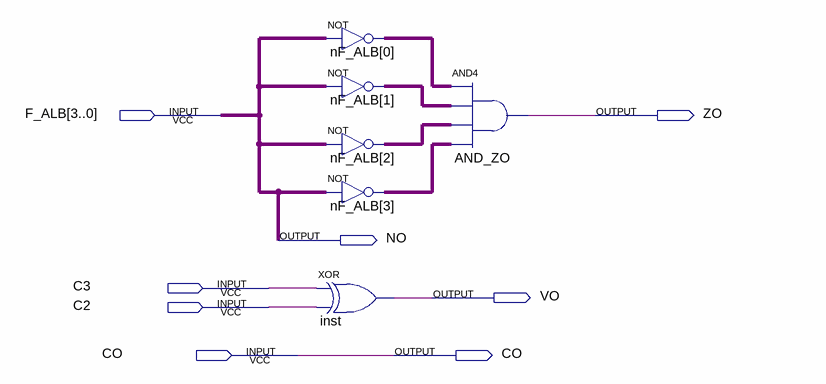
[diagram p0: schematic sheet]
// Quartus schematic flags.bdf as structural Verilog: 6 symbols, 8 pins
module flags (
  input  [3:0] F_ALB,
  input  C3,
  input  C2,
  inout  CO,
  output ZO,
  output NO,
  output VO
);

  wire [3:0] nF_ALB_0__out, nF_ALB_1__out, nF_ALB_2__out, nF_ALB_3__out;

  assign nF_ALB_0__out = ~F_ALB;  // NOT nF_ALB[0], 4 bits wide
  assign nF_ALB_1__out = ~F_ALB;  // NOT nF_ALB[1], 4 bits wide
  assign nF_ALB_2__out = ~F_ALB;  // NOT nF_ALB[2], 4 bits wide
  assign nF_ALB_3__out = ~F_ALB;  // NOT nF_ALB[3], 4 bits wide
  xor inst (VO, C3, C2);
  assign ZO = nF_ALB_0__out & nF_ALB_1__out & nF_ALB_2__out & nF_ALB_3__out;  // AND4 AND_ZO, 4 bits wide
endmodule
